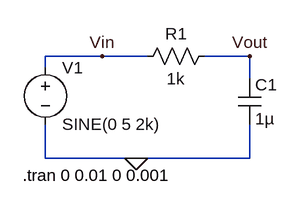
[diagram p0: schematic probando.asc]
probando.asc, the LTspice schematic file:
Version 4
SHEET 1 880 680
WIRE 48 112 -32 112
WIRE 112 112 48 112
WIRE 256 112 192 112
WIRE -32 128 -32 112
WIRE 256 144 256 112
WIRE -32 256 -32 208
WIRE 96 256 -32 256
WIRE 256 256 256 208
WIRE 256 256 96 256
FLAG 96 256 0
FLAG 48 112 Vin
FLAG 256 112 Vout
SYMBOL res 208 96 R90
WINDOW 0 0 56 VBottom 2
WINDOW 3 32 56 VTop 2
SYMATTR InstName R1
SYMATTR Value 1k
SYMBOL cap 240 144 R0
SYMATTR InstName C1
SYMATTR Value 1µ
SYMBOL voltage -32 112 R0
WINDOW 123 0 0 Left 0
WINDOW 39 0 0 Left 0
SYMATTR InstName V1
SYMATTR Value SINE(0 5 2k)
TEXT -64 280 Left 2 !.tran 0 0.01 0 0.001

The netlist it stands for:
* probando.asc
R1 Vout Vin 1k
C1 Vout 0 1µ
V1 Vin 0 SINE(0 5 2k)
.tran 0 0.01 0 0.001
.backanno
.end